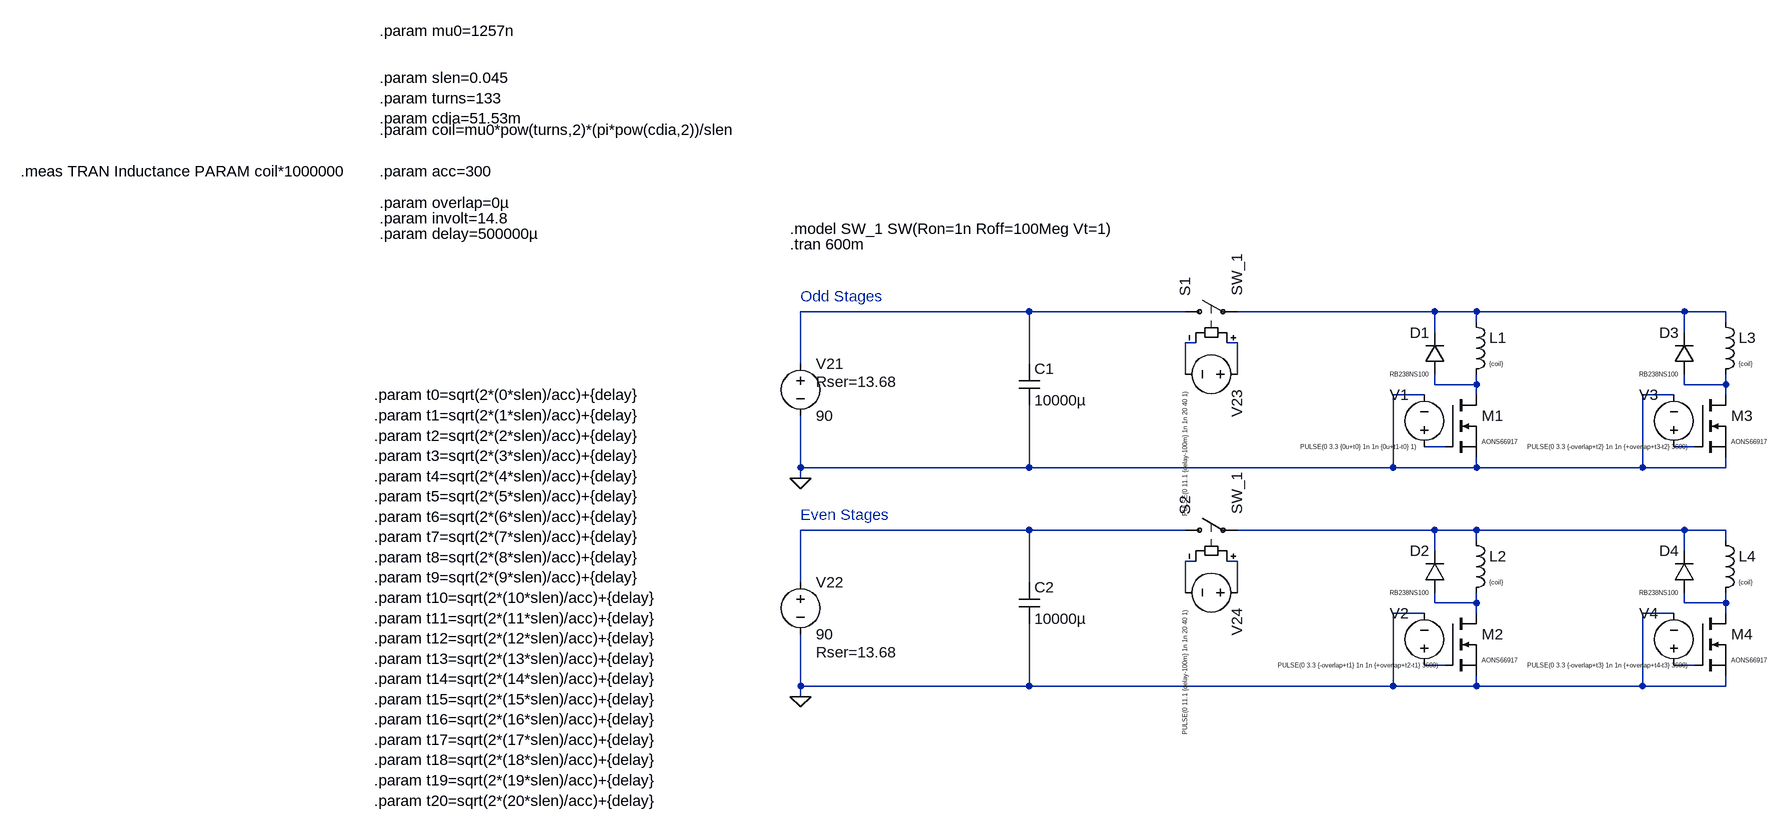
[diagram p0: schematic coilgun4-nmos-twocap.asc]
coilgun4-nmos-twocap.asc, the LTspice schematic file:
Version 4.1
SHEET 1 8016 1416
WIRE 64 -160 -288 -160
WIRE 304 -160 64 -160
WIRE 688 -160 384 -160
WIRE 752 -160 688 -160
WIRE 1072 -160 752 -160
WIRE 1136 -160 1072 -160
WIRE 752 -144 752 -160
WIRE 1136 -144 1136 -160
WIRE 688 -128 688 -160
WIRE 1072 -128 1072 -160
WIRE 320 -112 304 -112
WIRE 384 -112 368 -112
WIRE -288 -80 -288 -160
WIRE 64 -80 64 -160
WIRE 304 -64 304 -112
WIRE 384 -64 384 -112
WIRE 688 -48 688 -64
WIRE 752 -48 752 -64
WIRE 752 -48 688 -48
WIRE 1072 -48 1072 -64
WIRE 1136 -48 1136 -64
WIRE 1136 -48 1072 -48
WIRE 672 -32 624 -32
WIRE 752 -32 752 -48
WIRE 1056 -32 1008 -32
WIRE 1136 -32 1136 -48
WIRE 704 48 672 48
WIRE 1088 48 1056 48
WIRE -288 80 -288 0
WIRE 64 80 64 -16
WIRE 64 80 -288 80
WIRE 624 80 624 -32
WIRE 624 80 64 80
WIRE 752 80 752 64
WIRE 752 80 624 80
WIRE 1008 80 1008 -32
WIRE 1008 80 752 80
WIRE 1136 80 1136 64
WIRE 1136 80 1008 80
WIRE -288 96 -288 80
WIRE 64 176 -288 176
WIRE 304 176 64 176
WIRE 688 176 384 176
WIRE 752 176 688 176
WIRE 1072 176 752 176
WIRE 1136 176 1072 176
WIRE 752 192 752 176
WIRE 1136 192 1136 176
WIRE 688 208 688 176
WIRE 1072 208 1072 176
WIRE 320 224 304 224
WIRE 384 224 368 224
WIRE -288 256 -288 176
WIRE 64 256 64 176
WIRE 304 272 304 224
WIRE 384 272 384 224
WIRE 688 288 688 272
WIRE 752 288 752 272
WIRE 752 288 688 288
WIRE 1072 288 1072 272
WIRE 1136 288 1136 272
WIRE 1136 288 1072 288
WIRE 672 304 624 304
WIRE 752 304 752 288
WIRE 1056 304 1008 304
WIRE 1136 304 1136 288
WIRE 704 384 672 384
WIRE 1088 384 1056 384
WIRE -288 416 -288 336
WIRE 64 416 64 320
WIRE 64 416 -288 416
WIRE 624 416 624 304
WIRE 624 416 64 416
WIRE 752 416 752 400
WIRE 752 416 624 416
WIRE 1008 416 1008 304
WIRE 1008 416 752 416
WIRE 1136 416 1136 400
WIRE 1136 416 1008 416
WIRE -288 432 -288 416
FLAG -288 96 0
FLAG -288 432 0
SYMBOL voltage -288 -96 R0
WINDOW 123 0 0 Left 0
WINDOW 39 24 44 Left 2
SYMATTR SpiceLine Rser=13.68
SYMATTR InstName V21
SYMATTR Value 90
SYMBOL cap 48 -80 R0
SYMATTR InstName C1
SYMATTR Value 10000µ
SYMATTR SpiceLine V=100
SYMBOL voltage 672 64 R180
WINDOW 0 24 96 Left 2
WINDOW 3 100 10 Top 0
WINDOW 123 0 0 Left 0
WINDOW 39 0 0 Left 0
SYMATTR InstName V1
SYMATTR Value PULSE(0 3.3 {0u+t0} 1n 1n {0u+t1-t0} 1)
SYMBOL ind 736 -160 R0
WINDOW 3 36 80 Left 0
SYMATTR InstName L1
SYMATTR Value {coil}
SYMBOL nmos 704 -32 R0
WINDOW 3 56 72 Left 0
SYMATTR InstName M1
SYMATTR Value AONS66917
SYMBOL diode 704 -64 R180
WINDOW 0 24 64 Left 2
WINDOW 3 24 0 Left 0
SYMATTR InstName D1
SYMATTR Value RB238NS100
SYMATTR Description Diode
SYMATTR Type diode
SYMBOL sw 288 -160 R270
SYMATTR InstName S1
SYMATTR Value SW_1
SYMBOL voltage 400 -64 R90
WINDOW 123 0 0 Left 0
WINDOW 39 24 124 Left 2
WINDOW 3 24 96 Left 0
SYMATTR InstName V23
SYMATTR Value PULSE(0 11.1 {delay-100m} 1n 1n 20 40 1)
SYMBOL voltage -288 240 R0
WINDOW 123 0 0 Left 0
WINDOW 39 24 124 Left 2
SYMATTR SpiceLine Rser=13.68
SYMATTR InstName V22
SYMATTR Value 90
SYMBOL cap 48 256 R0
SYMATTR InstName C2
SYMATTR Value 10000µ
SYMATTR SpiceLine V=100
SYMBOL voltage 672 400 R180
WINDOW 0 24 96 Left 2
WINDOW 3 100 10 Top 0
WINDOW 123 0 0 Left 0
WINDOW 39 0 0 Left 0
SYMATTR InstName V2
SYMATTR Value PULSE(0 3.3 {-overlap+t1} 1n 1n {+overlap+t2-t1} 3600)
SYMBOL ind 736 176 R0
WINDOW 3 36 80 Left 0
SYMATTR InstName L2
SYMATTR Value {coil}
SYMBOL nmos 704 304 R0
WINDOW 3 56 72 Left 0
SYMATTR InstName M2
SYMATTR Value AONS66917
SYMBOL diode 704 272 R180
WINDOW 0 24 64 Left 2
WINDOW 3 24 0 Left 0
SYMATTR InstName D2
SYMATTR Value RB238NS100
SYMATTR Description Diode
SYMATTR Type diode
SYMBOL sw 288 176 R270
SYMATTR InstName S2
SYMATTR Value SW_1
SYMBOL voltage 400 272 R90
WINDOW 123 0 0 Left 0
WINDOW 39 24 124 Left 2
WINDOW 3 24 96 Left 0
SYMATTR InstName V24
SYMATTR Value PULSE(0 11.1 {delay-100m} 1n 1n 20 40 1)
SYMBOL voltage 1056 64 R180
WINDOW 0 24 96 Left 2
WINDOW 3 100 10 Top 0
WINDOW 123 0 0 Left 0
WINDOW 39 0 0 Left 0
SYMATTR InstName V3
SYMATTR Value PULSE(0 3.3 {-overlap+t2} 1n 1n {+overlap+t3-t2} 3600)
SYMBOL ind 1120 -160 R0
WINDOW 3 36 80 Left 0
SYMATTR InstName L3
SYMATTR Value {coil}
SYMBOL nmos 1088 -32 R0
WINDOW 3 56 72 Left 0
SYMATTR InstName M3
SYMATTR Value AONS66917
SYMBOL diode 1088 -64 R180
WINDOW 0 24 64 Left 2
WINDOW 3 24 0 Left 0
SYMATTR InstName D3
SYMATTR Value RB238NS100
SYMATTR Description Diode
SYMATTR Type diode
SYMBOL voltage 1056 400 R180
WINDOW 0 24 96 Left 2
WINDOW 3 100 10 Top 0
WINDOW 123 0 0 Left 0
WINDOW 39 0 0 Left 0
SYMATTR InstName V4
SYMATTR Value PULSE(0 3.3 {-overlap+t3} 1n 1n {+overlap+t4-t3} 3600)
SYMBOL ind 1120 176 R0
WINDOW 3 36 80 Left 0
SYMATTR InstName L4
SYMATTR Value {coil}
SYMBOL nmos 1088 304 R0
WINDOW 3 56 72 Left 0
SYMATTR InstName M4
SYMATTR Value AONS66917
SYMBOL diode 1088 272 R180
WINDOW 0 24 64 Left 2
WINDOW 3 24 0 Left 0
SYMATTR InstName D4
SYMATTR Value RB238NS100
SYMATTR Description Diode
SYMATTR Type diode
TEXT -304 -264 Left 2 !.tran 600m
TEXT -304 -288 Left 2 !.model SW_1 SW(Ron=1n Roff=100Meg Vt=1)
TEXT -288 -184 Left 2 ;Odd Stages
TEXT -936 -440 Left 2 !.param coil=mu0*pow(turns,2)*(pi*pow(cdia,2))/slen
TEXT -944 -32 Left 2 !.param t0=sqrt(2*(0*slen)/acc)+{delay}\n.param t1=sqrt(2*(1*slen)/acc)+{delay}\n.param t2=sqrt(2*(2*slen)/acc)+{delay}\n.param t3=sqrt(2*(3*slen)/acc)+{delay}\n.param t4=sqrt(2*(4*slen)/acc)+{delay}\n.param t5=sqrt(2*(5*slen)/acc)+{delay}\n.param t6=sqrt(2*(6*slen)/acc)+{delay}\n.param t7=sqrt(2*(7*slen)/acc)+{delay}\n.param t8=sqrt(2*(8*slen)/acc)+{delay}\n.param t9=sqrt(2*(9*slen)/acc)+{delay}\n.param t10=sqrt(2*(10*slen)/acc)+{delay}\n.param t11=sqrt(2*(11*slen)/acc)+{delay}\n.param t12=sqrt(2*(12*slen)/acc)+{delay}\n.param t13=sqrt(2*(13*slen)/acc)+{delay}\n.param t14=sqrt(2*(14*slen)/acc)+{delay}\n.param t15=sqrt(2*(15*slen)/acc)+{delay}\n.param t16=sqrt(2*(16*slen)/acc)+{delay}\n.param t17=sqrt(2*(17*slen)/acc)+{delay}\n.param t18=sqrt(2*(18*slen)/acc)+{delay}\n.param t19=sqrt(2*(19*slen)/acc)+{delay}\n.param t20=sqrt(2*(20*slen)/acc)+{delay}
TEXT -936 -376 Left 2 !.param acc=300
TEXT -936 -520 Left 2 !.param slen=0.045\n.param turns=133\n.param cdia=51.53m
TEXT -936 -328 Left 2 !.param overlap=0µ
TEXT -936 -304 Left 2 !.param involt=14.8
TEXT -936 -592 Left 2 !.param mu0=1257n
TEXT -1488 -376 Left 2 !.meas TRAN Inductance PARAM coil*1000000
TEXT -936 -280 Left 2 !.param delay=500000µ
TEXT -288 152 Left 2 ;Even Stages

The netlist it stands for:
* coilgun4-nmos-twocap.asc
V21 N001 0 90 Rser=13.68
C1 N001 0 10000µ V=100
V1 N007 0 PULSE(0 3.3 {0u+t0} 1n 1n {0u+t1-t0} 1)
L1 N002 N005 {coil}
M1 N005 N007 0 0 AONS66917
D1 N005 N002 RB238NS100
S1 N001 N002 N004 N003 SW_1
V23 N004 N003 PULSE(0 11.1 {delay-100m} 1n 1n 20 40 1)
V22 N009 0 90 Rser=13.68
C2 N009 0 10000µ V=100
V2 N015 0 PULSE(0 3.3 {-overlap+t1} 1n 1n {+overlap+t2-t1} 3600)
L2 N010 N013 {coil}
M2 N013 N015 0 0 AONS66917
D2 N013 N010 RB238NS100
S2 N009 N010 N012 N011 SW_1
V24 N012 N011 PULSE(0 11.1 {delay-100m} 1n 1n 20 40 1)
V3 N008 0 PULSE(0 3.3 {-overlap+t2} 1n 1n {+overlap+t3-t2} 3600)
L3 N002 N006 {coil}
M3 N006 N008 0 0 AONS66917
D3 N006 N002 RB238NS100
V4 N016 0 PULSE(0 3.3 {-overlap+t3} 1n 1n {+overlap+t4-t3} 3600)
L4 N010 N014 {coil}
M4 N014 N016 0 0 AONS66917
D4 N014 N010 RB238NS100
.model D D
.lib standard.dio
.model NMOS NMOS
.model PMOS PMOS
.lib standard.mos
.tran 600m
.model SW_1 SW(Ron=1n Roff=100Meg Vt=1)
* Odd Stages
.param coil=mu0*pow(turns,2)*(pi*pow(cdia,2))/slen
.param t0=sqrt(2*(0*slen)/acc)+{delay}
.param t1=sqrt(2*(1*slen)/acc)+{delay}
.param t2=sqrt(2*(2*slen)/acc)+{delay}
.param t3=sqrt(2*(3*slen)/acc)+{delay}
.param t4=sqrt(2*(4*slen)/acc)+{delay}
.param t5=sqrt(2*(5*slen)/acc)+{delay}
.param t6=sqrt(2*(6*slen)/acc)+{delay}
.param t7=sqrt(2*(7*slen)/acc)+{delay}
.param t8=sqrt(2*(8*slen)/acc)+{delay}
.param t9=sqrt(2*(9*slen)/acc)+{delay}
.param t10=sqrt(2*(10*slen)/acc)+{delay}
.param t11=sqrt(2*(11*slen)/acc)+{delay}
.param t12=sqrt(2*(12*slen)/acc)+{delay}
.param t13=sqrt(2*(13*slen)/acc)+{delay}
.param t14=sqrt(2*(14*slen)/acc)+{delay}
.param t15=sqrt(2*(15*slen)/acc)+{delay}
.param t16=sqrt(2*(16*slen)/acc)+{delay}
.param t17=sqrt(2*(17*slen)/acc)+{delay}
.param t18=sqrt(2*(18*slen)/acc)+{delay}
.param t19=sqrt(2*(19*slen)/acc)+{delay}
.param t20=sqrt(2*(20*slen)/acc)+{delay}
.param acc=300
.param slen=0.045
.param turns=133
.param cdia=51.53m
.param overlap=0µ
.param involt=14.8
.param mu0=1257n
.meas TRAN Inductance PARAM coil*1000000
.param delay=500000µ
* Even Stages
.backanno
.end